# EAGLE design optical_modul (EAGLE 9.4.2)
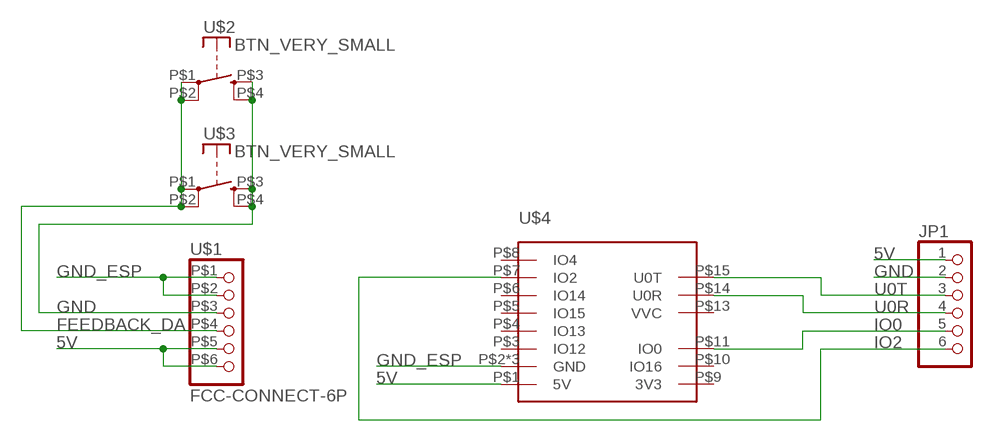
[diagram p0: schematic, sheet 1]

## Parts
JP1  PINHD-1X6  [1X06]
U$1  FCC-CONNECT-6P  [FFC-CONNECT-6P-SMD]
U$2  BTN_VERY_SMALL  [BTN_VERY_SMALL]
U$3  BTN_VERY_SMALL  [BTN_VERY_SMALL]
U$4  ESP32-CAM  [ESP32-CAM]

## Nets
5V: JP1.1 U$1.P$5 U$1.P$6 U$4.P$1(5V)
FEEDBACK_DA: U$1.P$4 U$2.P$1(P) U$2.P$2(P) U$3.P$1(P) U$3.P$2(P)
GND: JP1.2 U$1.P$3 U$2.P$3(S) U$2.P$4(S) U$3.P$3(S) U$3.P$4(S)
GND_ESP: U$1.P$1 U$1.P$2 U$4.P$2(GND) U$4.P$12(GND) U$4.P$16(GND)
IO0: JP1.5 U$4.P$11(IO0)
IO2: JP1.6 U$4.P$7(IO2)
U0R: JP1.4 U$4.P$14(U0R)
U0T: JP1.3 U$4.P$15(U0T)
Unconnected: U$4.P$3(IO12) U$4.P$4(IO13) U$4.P$5(IO15) U$4.P$6(IO14) U$4.P$8(IO4) U$4.P$9(3V3) U$4.P$10(IO16) U$4.P$13(VVC)

## Library data of the parts
JP1 = pinhead:PINHD-1X6: PIN HEADER
U$1 = NEON-BLADE-2023:FCC-CONNECT-6P
U$2 U$3 = NEON-BLADE-2023:BTN_VERY_SMALL
U$4 = NEON-BLADE-2023:ESP32-CAM

## Board
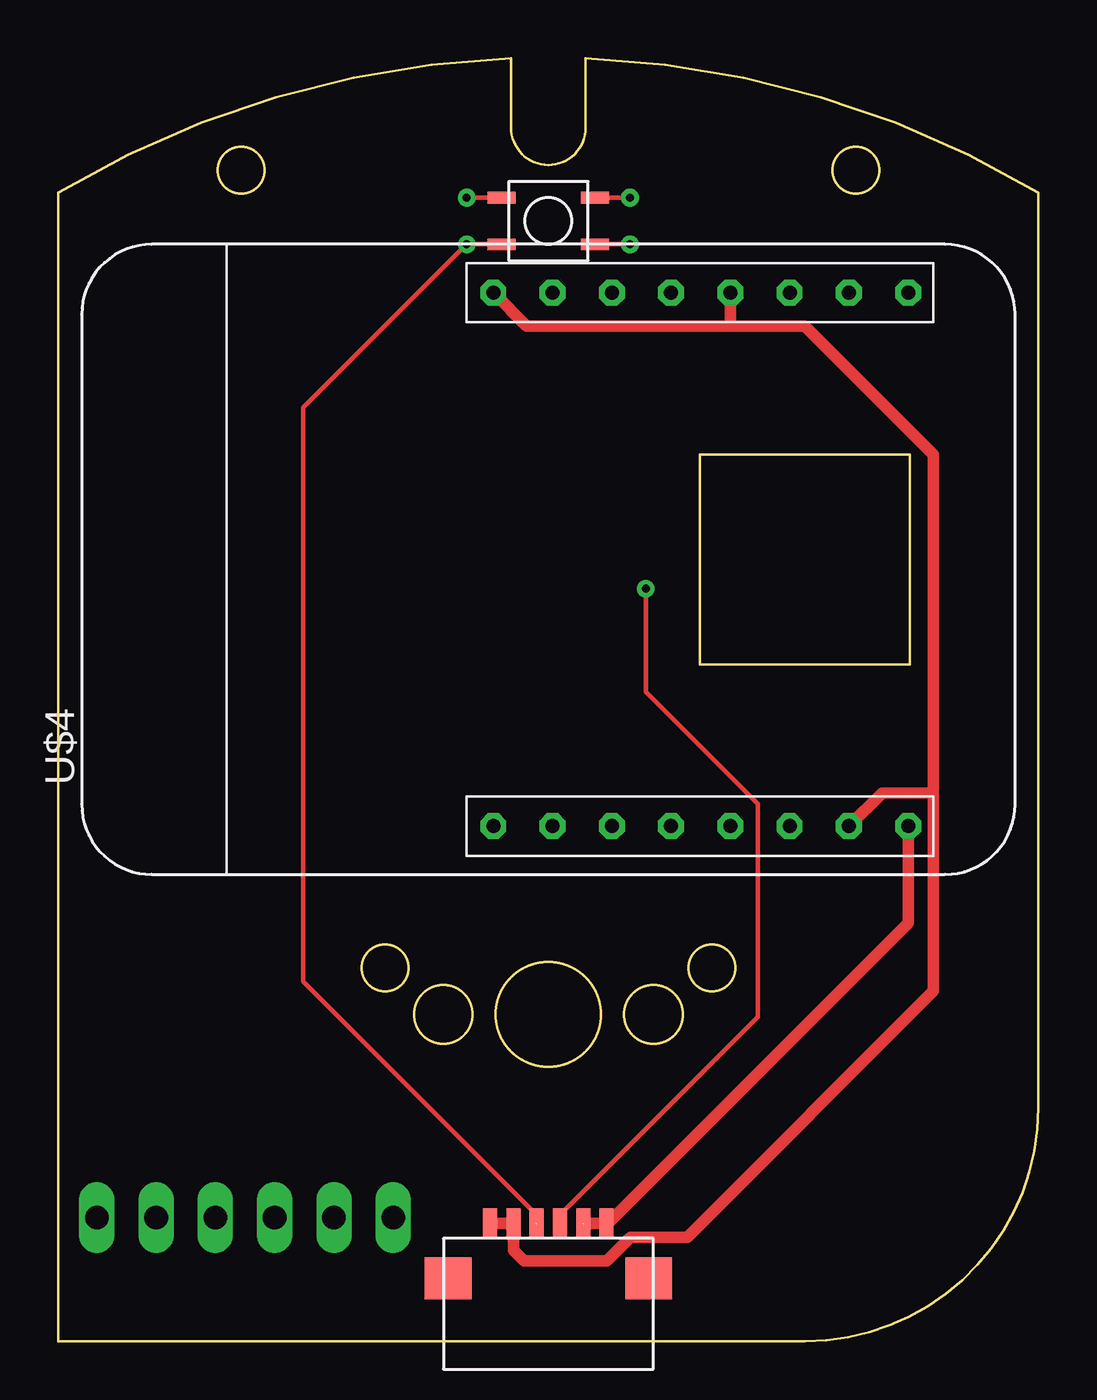
[diagram p1: board, top side]
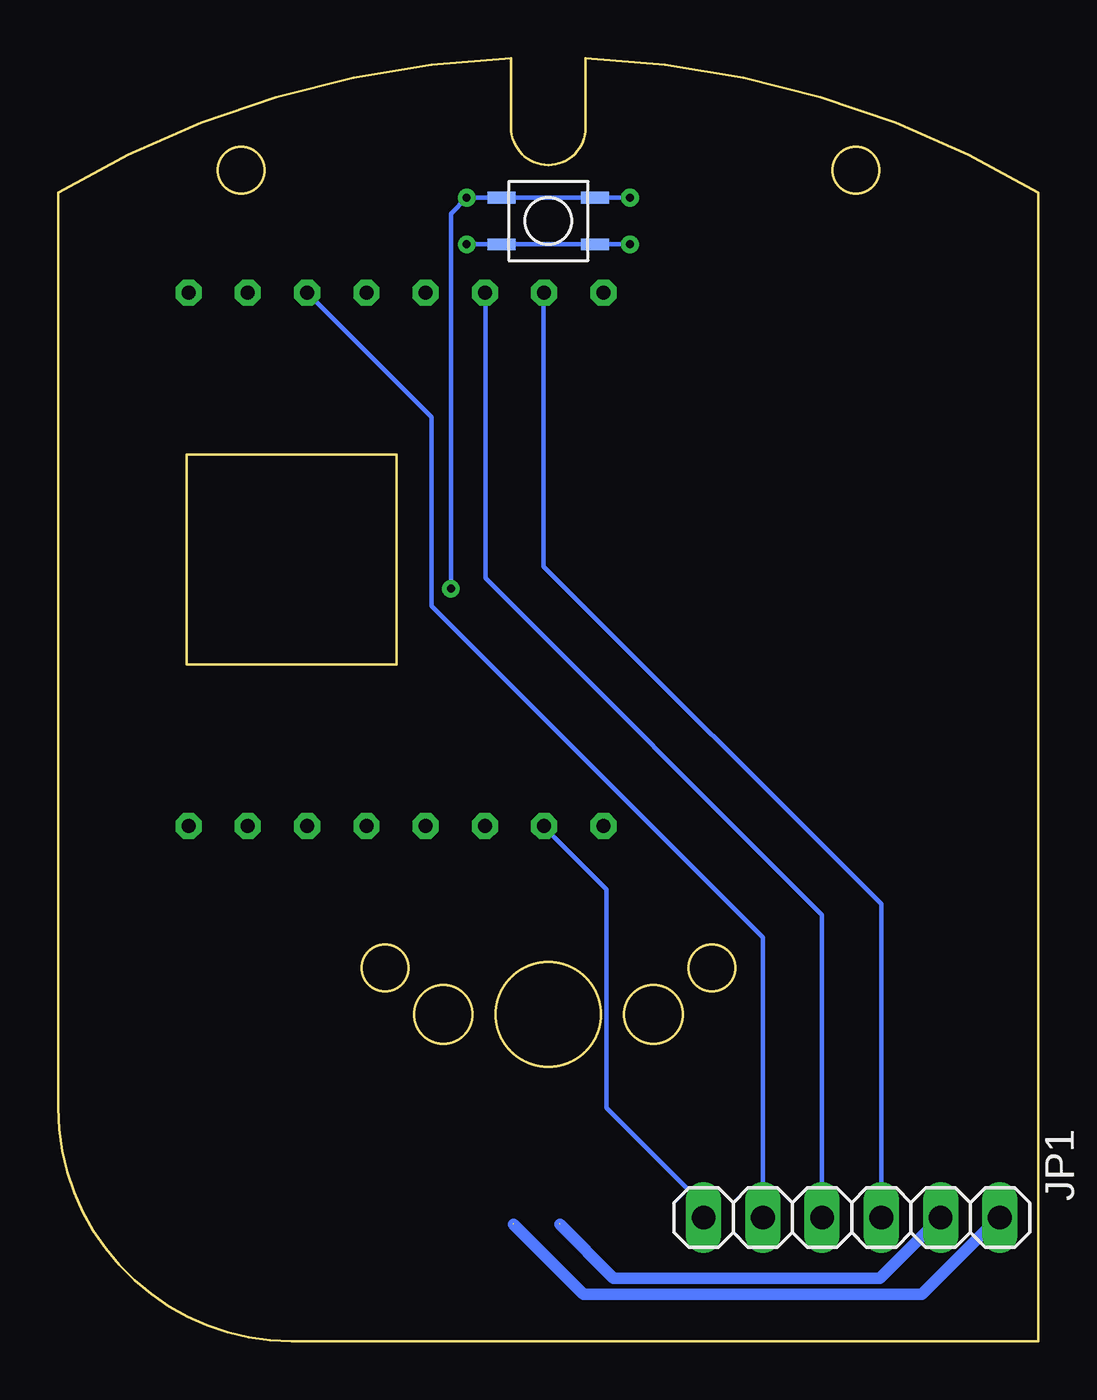
[diagram p2: board, bottom side, seen from below]

Size 42 x 54.97 mm. Coordinates in mm from the lower left corner, seen from the top.
Outline: 32,0 0,0 0,49.21 arc-29 19.4,54.97 19.4,52 arc180 22.6,52 22.6,54.97 arc-29 42,49.21 42,10 arc-90 32,0
Outline: 27.5,29 36.5,29 36.5,38 27.5,38 27.5,29
Outline: circle at 21,14 radius 2.25
Outline: circle at 25.5,14 radius 1.25
Outline: circle at 16.5,14 radius 1.25
Outline: circle at 34.17,50.18 radius 1
Outline: circle at 28,16 radius 1
Outline: circle at 7.83,50.18 radius 1
Outline: circle at 14,16 radius 1
Copper layers (1*16): Top 0.035mm / dielectric 1.5mm / Bottom 0.035mm
Design rules "default *": minimum track width 0.2mm, minimum drill 0.35mm, track to track 0.2mm, track to pad 0.2mm, pad to pad 0.2mm, via to via 0.2mm, smd to smd 0.2mm, copper to edge 0.1mm, drill to drill 6mil, minimum pad ring 10mil, minimum via ring 8mil, stop-mask expansion 4mil, vias tented up to drill 0mil, thermal gap 10mil

### Footprints (pad centres in the part's own frame; a part is rotated, then mirrored left to right if it is on the bottom)
1X06 = drill 1.016 long: 1 -6.35,0; 2 -3.81,0; 3 -1.27,0; 4 1.27,0; 5 3.81,0; 6 6.35,0
FFC-CONNECT-6P-SMD = smd 0.6 x 1.3: P$1 -7,0.65; P$2 -6,0.65; P$3 -5,0.65; P$4 -4,0.65; P$5 -3,0.65; P$6 -2,0.65 | smd 2 x 1.8: P$16 -0.2,-1.7; P$17 -8.8,-1.7
BTN_VERY_SMALL = smd 1.2 x 0.5: P$1 -2,1; P$2 2,1; P$3 2,-1; P$4 -2,-1
ESP32-CAM = drill 0.6 octagon: P$1 -11.43,-15.42; P$2 -11.43,-12.88; P$3 -11.43,-10.34; P$4 -11.43,-7.8; P$5 -11.43,-5.26; P$6 -11.43,-2.72; P$7 -11.43,-0.18; P$8 -11.43,2.36; P$9 11.43,-15.42; P$10 11.43,-12.88; P$11 11.43,-10.34; P$12 11.43,-7.8; P$13 11.43,-5.26; P$14 11.43,-2.72; P$15 11.43,-0.18; P$16 11.43,2.36

### Placement (x,y rotation side)
JP1  8,5.3 180 bottom
U$1  25.5,4.4 0 top
U$2  21,48 0 top
U$3  21,48 0 bottom
U$4  21,33.5 90 top

### Tracks (layer width: path | path; a pad name or v marks a point on that pad's centre or on a via)
5V  (1 unrouted)
  Top 0.5: U$1.P$5 U$1.P$6 23.55,5.05 36.42,17.92 U$4.P$1
  Bottom 0.5: JP1.1 1.7,5.3 5,2 19.5,2 22.5,5
FEEDBACK_DA  (via drill 0.35)
  Top 0.2: v17.5,49 U$3.P$2 | v24.5,49 U$3.P$1 | U$1.P$4 21.5,5.42 29.98,13.9 29.98,23.02 25.18,27.82 v25.18,32.25
  Bottom 0.2: v17.5,49 U$3.P$2 U$3.P$1 v24.5,49 25.18,48.32 v25.18,32.25
GND  (via drill 0.35)  (1 unrouted)
  Top 0.2: U$3.P$3 v17.5,47 10.5,40 10.5,15.42 20.5,5.42 U$1.P$3 | U$3.P$4 v24.5,47
  Bottom 0.2: v17.5,47 U$3.P$3 U$3.P$4 v24.5,47
  Bottom 0.5: JP1.2 6.79,2.7 18.2,2.7 20.5,5
GND_ESP
  Top 0.2: 28.8,44.97 U$4.P$12
  Top 0.5: U$1.P$1 U$1.P$2 19.5,3.9 19.95,3.45 23.51,3.45 24.51,4.45 26.95,4.45 37.5,15 37.5,23.5 | 28.8,43.5 32,43.5 37.5,38 37.5,23.5 | 28.8,44.97 28.8,43.5 | U$4.P$2 35.31,23.5 37.5,23.5 | U$4.P$16 20.07,43.5 28.8,43.5
IO0
  Bottom 0.2: JP1.5 11.81,17.31 26,31.5 26,39.59 U$4.P$11
IO2
  Bottom 0.2: JP1.6 14.35,5.85 18.5,10 18.5,19.35 21.18,22.03 U$4.P$7
U0R
  Bottom 0.2: JP1.4 9.27,18.27 23.7,32.7 23.7,44.91 U$4.P$14
U0T
  Bottom 0.2: JP1.3 6.73,18.73 21.2,33.2 21.2,44.91 U$4.P$15